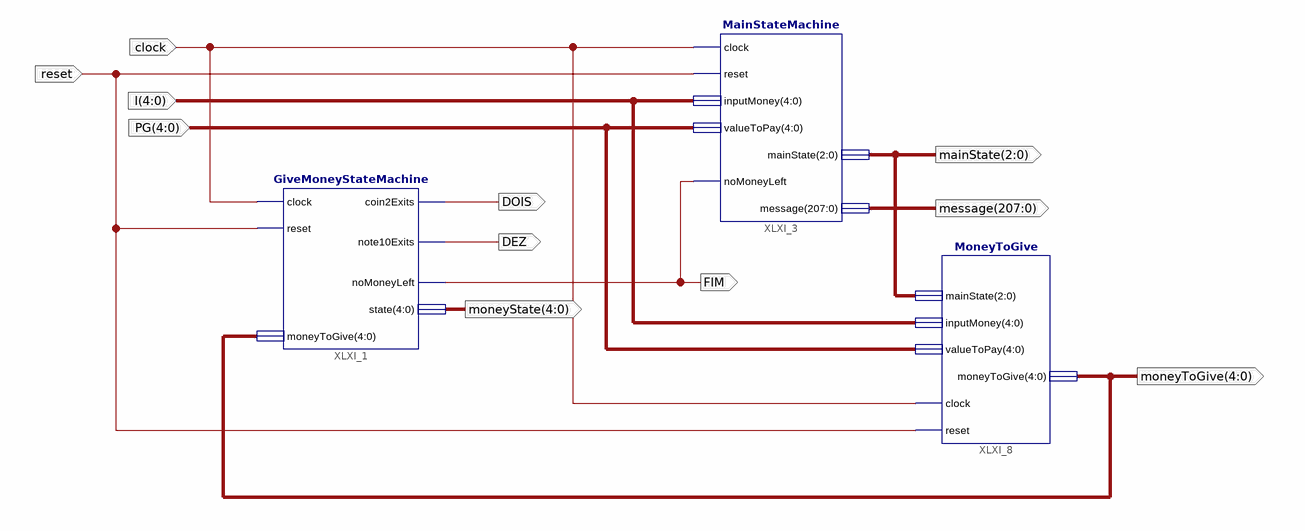
[diagram p0: schematic sheet 1]
// Xilinx ISE schematic Schematic.sch (artix7) as structural Verilog: 3 symbols, 11 ports
module Schematic (
  input  [4:0] I,
  input  [4:0] PG,
  input  clock,
  input  reset,
  output DOIS,
  output FIM,
  output DEZ,
  output [4:0] moneyState,
  output [4:0] moneyToGive,
  output [2:0] mainState,
  output [207:0] message
);

  MainStateMachine XLXI_3 (
    .clock(clock), .reset(reset), .noMoneyLeft(FIM), .inputMoney(I), .valueToPay(PG), .mainState(mainState),
    .message(message));
  MoneyToGive XLXI_8 (
    .clock(clock), .mainState(mainState), .inputMoney(I), .valueToPay(PG), .moneyToGive(moneyToGive),
    .reset(reset));
  GiveMoneyStateMachine XLXI_1 (
    .clock(clock), .reset(reset), .moneyToGive(moneyToGive), .coin2Exits(DOIS), .note10Exits(DEZ),
    .noMoneyLeft(FIM), .state(moneyState));
endmodule
